# Altium schematic sheet Sheet3.SchDoc
size A4
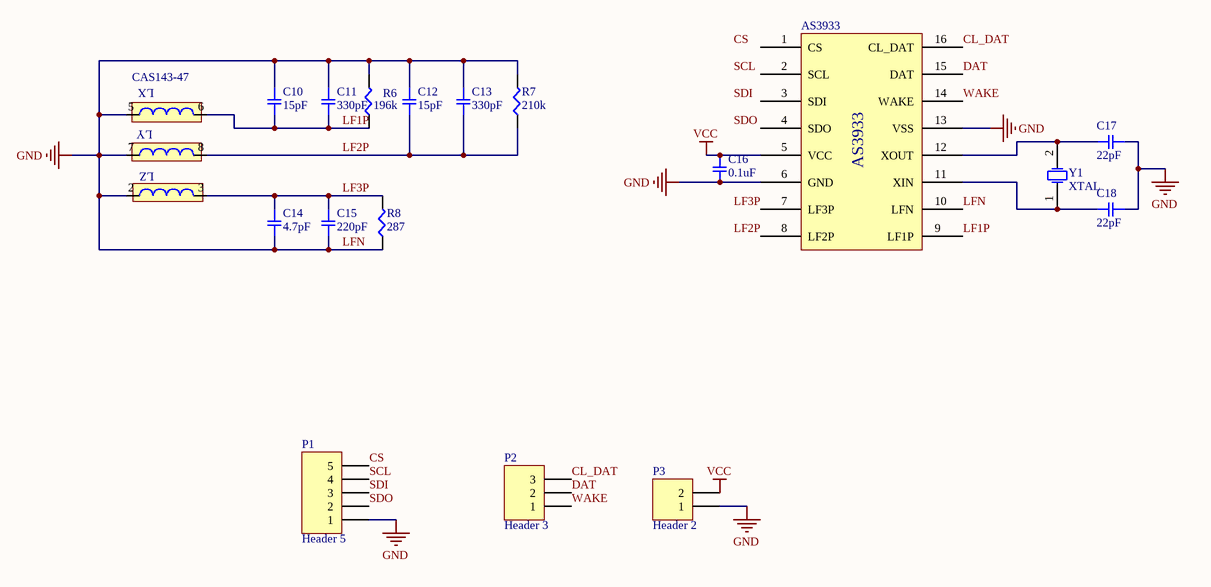
[diagram p0: Sheet3.SchDoc]

## Parts
AS3933  (no value)  [TSOP65P640X110-16N]
C10  15pF  [SMD-0805C]
C11  330pF  [SMD-0805C]
C12  15pF  [SMD-0805C]
C13  330pF  [SMD-0805C]
C14  4.7pF  [SMD-0805C]
C15  220pF  [SMD-0805C]
C16  0.1uF  [SMD-0805C]
C17  22pF  [SMD-0805C]
C18  22pF  [SMD-0805C]
CAS143-47  CAS143-47  [CAS143-47]  (value not drawn)
P1  Header 5  [HDR1X5]
P2  Header 3  [HDR1X3]
P3  Header 2  [HDR1X2]
R6  196k  [SMD-0805-RES]
R7  210k  [SMD-0805-RES]
R8  287  [SMD-0805-RES]
Y1  XTAL  [R38]

## Nets
LFN: AS3933.6(GND) AS3933.10(LFN) AS3933.13(VSS) C10.1 C11.1 C12.1 C13.1 C14.2 C15.2 C16.2 C17.1 C18.1 CAS143-47.2 CAS143-47.5 CAS143-47.7 P1.1 P3.1 R6.2 R7.2 R8.1  [also labelled GND]
VCC: AS3933.5(VCC) C16.1 P3.2
CL_DAT: AS3933.16(CL_DAT) P2.3
CS: P1.5
DAT: AS3933.15(DAT) P2.2
LF1P: AS3933.9(LF1P) C10.2 C11.2 CAS143-47.6 R6.1
LF2P: C12.2 C13.2 CAS143-47.8 R7.1
LF3P: C14.1 C15.1 CAS143-47.3 R8.2
SCL: P1.4
SDI: P1.3
SDO: P1.2
WAKE: AS3933.14(WAKE) P2.1
NetAS3933_11: AS3933.11(XIN) C18.2 Y1.1(OSC1)
NetAS3933_12: AS3933.12(XOUT) C17.2 Y1.2(OSC2)

Not connected (* = marked no-connect by the designer): AS3933 1(CS) 2(SCL) 3(SDI) 4(SDO) 7(LF3P) 8(LF2P)

## Notes on the sheet
- Labels drawn without touching a wire or pin: CS, LF2P, LF3P, SCL, SDI, SDO
- (in symbol Component_1) LX; LY; LZ

## Library data of the parts
AS3933 CAS143-47 = Component_1
C10 C12 = CC0805FRNPO9BN150: Cap Ceramic 15pF 50V C0G 1%  0805; Manufacturer: Yaego; Part Number: CC0805FRNPO9BN150; Package / Case: 0805; Voltage: 50V; Tolerance: 1%; VALUE: 15pF
C11 C13 = CC0805GRNPO9BN331: Cap Ceramic 330pF 50V C0G 2%  0805; Manufacturer: Yageo; Part Number: CC0805GRNPO9BN331; Package / Case: 0805; Voltage: 50V; Tolerance: 2%; VALUE: 330pF
C14 = CL21C4R7BBANNNC: Cap Ceramic 4.7pF 50V C0G 0.1pF  0805; Manufacturer: Samsung Electro-Mechanics; Part Number: CL21C4R7BBANNNC; Package / Case: 0805; Voltage: 50V; Tolerance: 0.1pF; VALUE: 4.7pF
C15 = GCM2165C2A221FA16D: Cap Ceramic 220pF 100V C0G 1% 0805; Manufacturer: Murata Manufacturing; Part Number: GCM2165C2A221FA16D; Package / Case: 0805; Voltage: 100V; Tolerance: 1%; VALUE: 220pF
C16 = CL21B104JBCNNNC: CAP CER 0.1uF 50V X7T 0805; Part Number: GC321AD72E103KX01D; Manufacturer: Samsung Electro-Mechanics; Tolerance: 5%; Package / Case: 0805; Voltage: 50V; VALUE: 0.1uF
C17 C18 = CL21C220JBANNND: Cap Ceramic 22pF 50V C0G 5%0805; Manufacturer: Samsung Electro-Mechanics; Voltage: 100V; Tolerance: 1%; Part Number: CL21C220JBANNND; Package / Case: 0805; VALUE: 22pF
P1 = Header 5: Header, 5-Pin; LatestRevisionDate: 17-Jul-2002; LatestRevisionNote: Re-released for DXP Platform.; Publisher: Altium Limited
P2 = Header 3: Header, 3-Pin; LatestRevisionDate: 17-Jul-2002; LatestRevisionNote: Re-released for DXP Platform.; Publisher: Altium Limited
P3 = Header 2: Header, 2-Pin; LatestRevisionDate: 17-Jul-2002; LatestRevisionNote: Re-released for DXP Platform.; Publisher: Altium Limited
R6 = ERJ-6ENF1963V: RES SMD 196K OHM 1% 1/8W 0805; Manufacturer: Panasonic Electronic Components; Factory Stock: 0; Unit Price (USD): 0.00729; @ qty: 1500; Minimum Quantity: 1; Power (Watts): 0.125W, 1/8W; Temperature Coefficient: ±100ppm/°C; Part Number: ERJ-6ENF1963V; Datasheets: http://industrial.panasonic.com/www-cgi/jvcr13pz.cgi?E+PZ+3+AOA0002+ERJ6ENF1963V+7+WW; Image: //media.digikey.com/Renders/Panasonic%20Renders/ERJ-0805%20Pkg.jpg; Digi-Key Part Number: P196KCCT-ND; Quantity Available: 10095; Packaging: Cut Tape (CT); Series: ERJ; Part Status: Active; Value: 196k; Tolerance: ±1%; Composition: Thick Film; Features: Automotive AEC-Q200; Operating Temperature: -55°C ~ 155°C; Package / Case: 0805 (2012 Metric); Supplier Device Package: 0805; Size / Dimension: 0.079" L x 0.049" W (2.00mm x 1.25mm); Height - Seated (Max): 0.028" (0.70mm); Number of Terminations: 2; Failure Rate: -
R7 = ERJ-6ENF2103V: RES SMD 210K OHM 1% 1/8W 0805; Manufacturer: Panasonic Electronic Components; Factory Stock: 0; Unit Price (USD): 0.00729; @ qty: 1500; Minimum Quantity: 1; Power (Watts): 0.125W, 1/8W; Temperature Coefficient: ±100ppm/°C; Part Number: ERJ-6ENF2103V; Datasheets: http://industrial.panasonic.com/www-cgi/jvcr13pz.cgi?E+PZ+3+AOA0002+ERJ6ENF2103V+7+WW; Image: //media.digikey.com/Renders/Panasonic%20Renders/ERJ-0805%20Pkg.jpg; Digi-Key Part Number: P210KCCT-ND; Quantity Available: 47308; Packaging: Cut Tape (CT); Series: ERJ; Part Status: Active; Value: 210k; Tolerance: ±1%; Composition: Thick Film; Features: Automotive AEC-Q200; Operating Temperature: -55°C ~ 155°C; Package / Case: 0805 (2012 Metric); Supplier Device Package: 0805; Size / Dimension: 0.079" L x 0.049" W (2.00mm x 1.25mm); Height - Seated (Max): 0.028" (0.70mm); Number of Terminations: 2; Failure Rate: -
R8 = ERJ-6ENF2870V: RES SMD 287 OHM 1% 1/8W 0805; Manufacturer: Panasonic Electronic Components; Factory Stock: 0; Unit Price (USD): 0.00729; @ qty: 1500; Minimum Quantity: 1; Power (Watts): 0.125W, 1/8W; Temperature Coefficient: ±100ppm/°C; Part Number: ERJ-6ENF2870V; Datasheets: http://industrial.panasonic.com/www-cgi/jvcr13pz.cgi?E+PZ+3+AOA0002+ERJ6ENF2870V+7+WW; Image: //media.digikey.com/Renders/Panasonic%20Renders/ERJ-0805%20Pkg.jpg; Digi-Key Part Number: P287CCT-ND; Quantity Available: 41477; Packaging: Cut Tape (CT); Series: ERJ; Part Status: Active; Value: 287; Tolerance: ±1%; Composition: Thick Film; Features: Automotive AEC-Q200; Operating Temperature: -55°C ~ 155°C; Package / Case: 0805 (2012 Metric); Supplier Device Package: 0805; Size / Dimension: 0.079" L x 0.049" W (2.00mm x 1.25mm); Height - Seated (Max): 0.028" (0.70mm); Number of Terminations: 2; Failure Rate: -
Y1 = XTAL: Crystal ABS07-32.768KHZ-T; Published: 8-Jun-2000; LatestRevisionDate: 17-Jul-2002; LatestRevisionNote: Re-released for DXP Platform.; PackageReference: R38; Publisher: Altium Limited; PackageDescription: Crystal, Thru-Hole; 2 Leads; Body 3.1 x 8.2 mm (Dia.xH); Part Number: ABS07-32.768KHZ-T